# Altium project Split_propu2026.PrjPcb
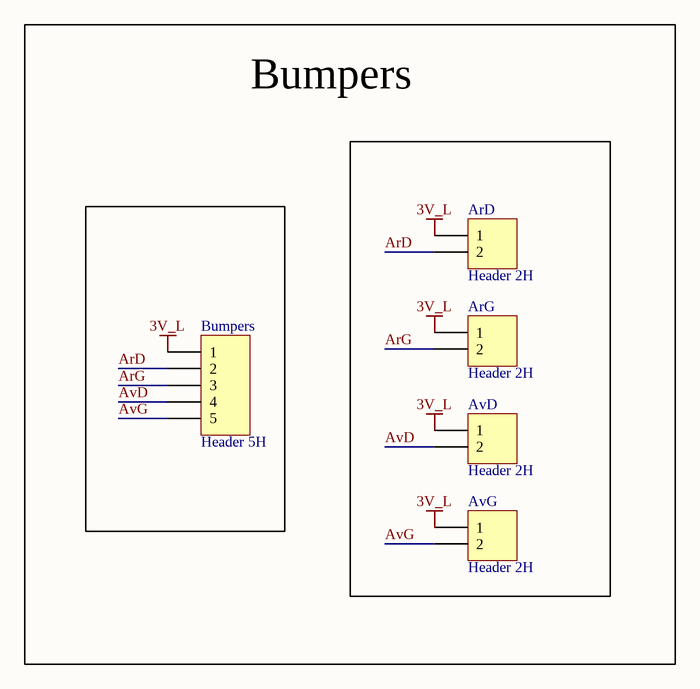
[diagram p0: Split_propu2026.SchDoc]
1 sheet, 5 parts. Net scope: global (net labels, ports and power ports of the same name join across sheets).
Board file: Split_propu2026.PcbDoc

## Sheet Split_propu2026.SchDoc
size A4; SheetNumber: 1; SheetTotal: 1

### Parts
ArD  Header 2H  [S2B-XH-A]
ArG  Header 2H  [S2B-XH-A]
AvD  Header 2H  [S2B-XH-A]
AvG  Header 2H  [S2B-XH-A]
Bumpers  Header 5H  [S5B-XH-A]

### Nets
3V_L: ArD.1 ArG.1 AvD.1 AvG.1 Bumpers.1
ArD: ArD.2 Bumpers.2
ArG: ArG.2 Bumpers.3
AvD: AvD.2 Bumpers.4
AvG: AvG.2 Bumpers.5

### Notes on the sheet
- Bumpers
- (near ArD) Extérieur
- Carte Action

### Library data of the parts
ArD ArG AvD AvG = Header 2H: Header, 2-Pin, Right Angle; LatestRevisionDate: 17-Jul-2002; LatestRevisionNote: Re-released for DXP Platform.; Publisher: Altium Limited
Bumpers = Header 5H: Header, 5-Pin, Right Angle; LatestRevisionDate: 17-Jul-2002; LatestRevisionNote: Re-released for DXP Platform.; Publisher: Altium Limited